# Altium schematic sheet pulsometro.SchDoc
size A3
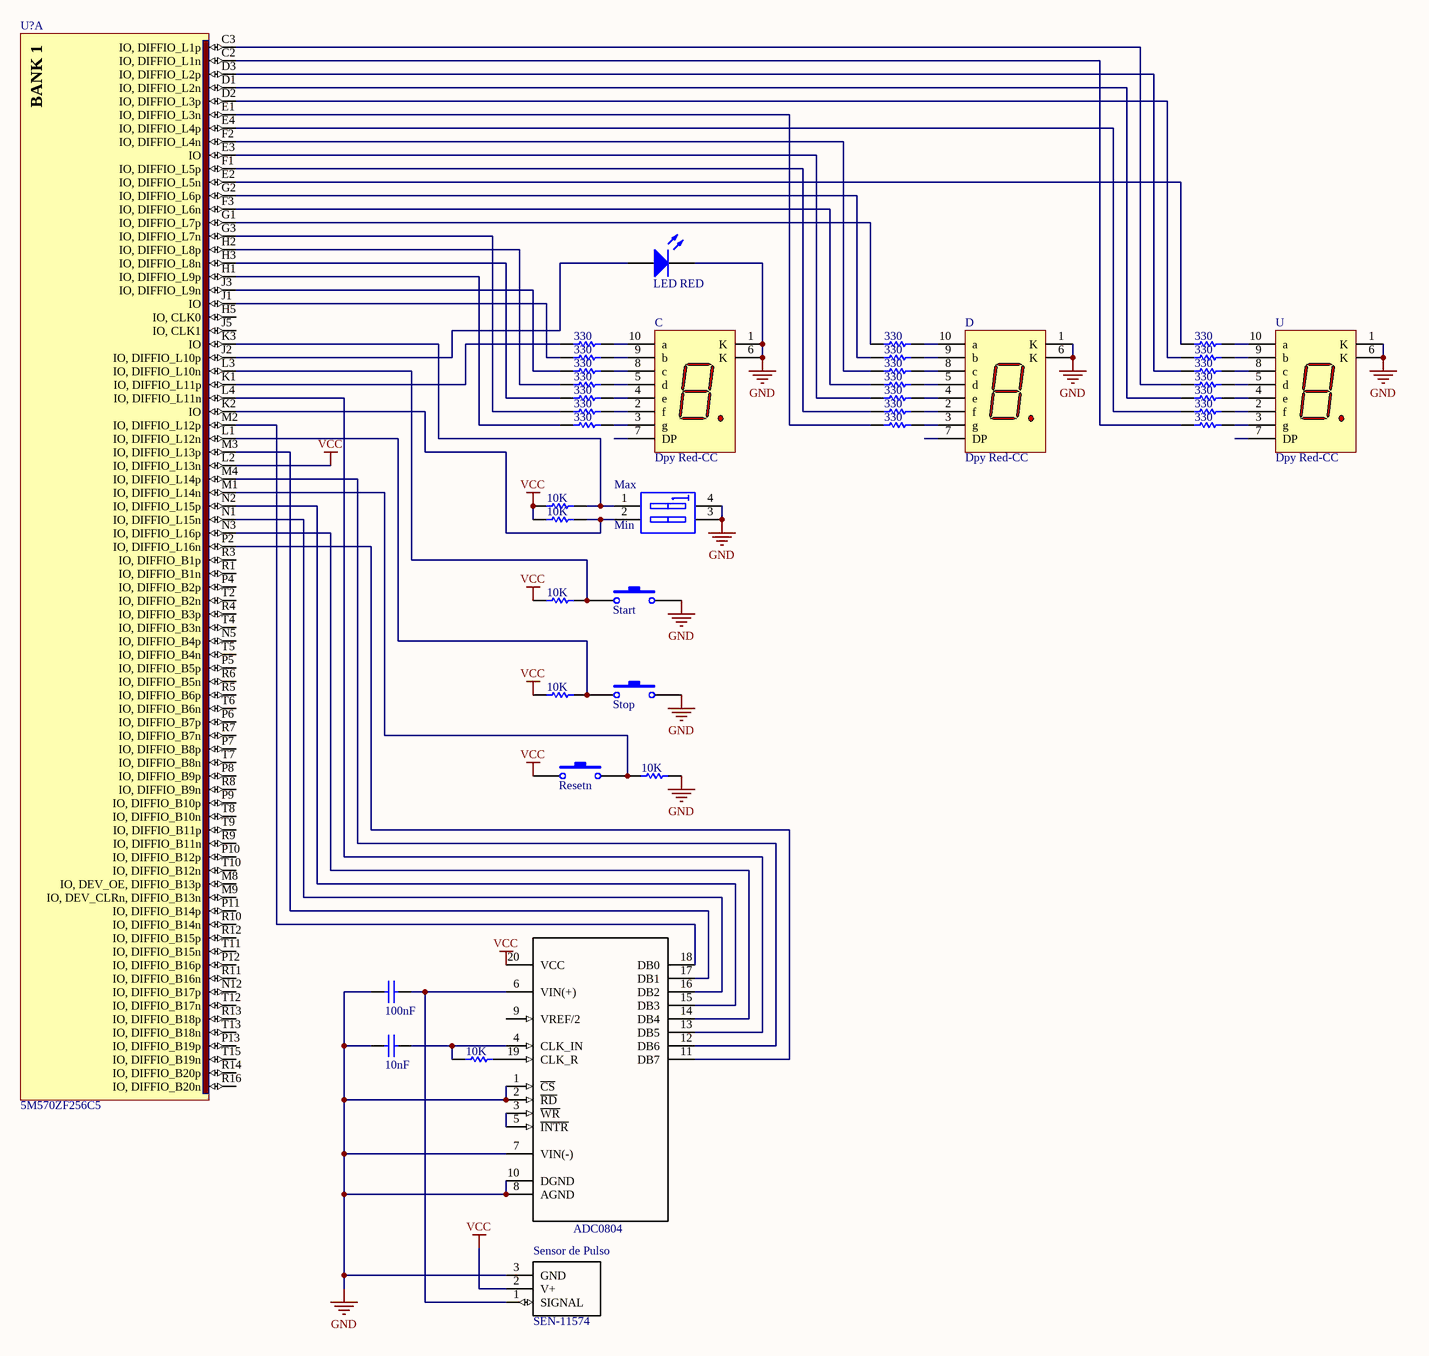
[diagram p0: pulsometro.SchDoc]

## Parts
(Parts that share a designator on the sheet are numbered #1, #2 ... from top to bottom, then left to right.)
C  Dpy Red-CC  [A]
C?#1  value 100nF  [RAD-0.3]  (hidden comment: Cap)
C?#2  value 10nF  [RAD-0.3]  (hidden comment: Cap)
D  Dpy Red-CC  [A]
D?  LED RED  [LED-0]
Max  Min  [DIP-4]
R?#1  value 330  [AXIAL-0.3]  (hidden comment: Res1)
R?#2  value 330  [AXIAL-0.3]  (hidden comment: Res1)
R?#3  value 330  [AXIAL-0.3]  (hidden comment: Res1)
R?#4  value 330  [AXIAL-0.3]  (hidden comment: Res1)
R?#5  value 330  [AXIAL-0.3]  (hidden comment: Res1)
R?#6  value 330  [AXIAL-0.3]  (hidden comment: Res1)
R?#7  value 330  [AXIAL-0.3]  (hidden comment: Res1)
R?#8  value 330  [AXIAL-0.3]  (hidden comment: Res1)
R?#9  value 330  [AXIAL-0.3]  (hidden comment: Res1)
R?#10  value 330  [AXIAL-0.3]  (hidden comment: Res1)
R?#11  value 330  [AXIAL-0.3]  (hidden comment: Res1)
R?#12  value 330  [AXIAL-0.3]  (hidden comment: Res1)
R?#13  value 330  [AXIAL-0.3]  (hidden comment: Res1)
R?#14  value 330  [AXIAL-0.3]  (hidden comment: Res1)
R?#15  value 330  [AXIAL-0.3]  (hidden comment: Res1)
R?#16  value 330  [AXIAL-0.3]  (hidden comment: Res1)
R?#17  value 330  [AXIAL-0.3]  (hidden comment: Res1)
R?#18  value 330  [AXIAL-0.3]  (hidden comment: Res1)
R?#19  value 330  [AXIAL-0.3]  (hidden comment: Res1)
R?#20  value 330  [AXIAL-0.3]  (hidden comment: Res1)
R?#21  value 330  [AXIAL-0.3]  (hidden comment: Res1)
R?#22  value 10K  [AXIAL-0.3]  (hidden comment: Res1)
R?#23  value 10K  [AXIAL-0.3]  (hidden comment: Res1)
R?#24  value 10K  [AXIAL-0.3]  (hidden comment: Res1)
R?#25  value 10K  [AXIAL-0.3]  (hidden comment: Res1)
R?#26  value 10K  [AXIAL-0.3]  (hidden comment: Res1)
R?#27  value 10K  [AXIAL-0.3]  (hidden comment: Res1)
S?#1  Start  [SPST-2]
S?#2  Stop  [SPST-2]
S?#3  Resetn  [SPST-2]
Sensor_de_Pulso  SEN-11574  [XDCR_SEN-11574]
U  Dpy Red-CC  [A]
U?#1  5M570ZF256C5  [FBGA256_A-155]  (part A of 5)
U?#2  ADC0804  [DIP254P762X508-20]

## Nets
GND: C.1(K) C.6(K) C?#1.1 C?#2.1 D.1(K) D.6(K) D?.2(K) Max.3(B2) Max.4(B1) R?#26.2 S?#1.2 S?#2.2 Sensor_de_Pulso.3(GND) U.1(K) U.6(K) U?#2.1(~{CS}) U?#2.2(~{RD}) U?#2.7(VIN(-)) U?#2.8(AGND) U?#2.10(DGND)
VCC: R?#22.1 R?#23.1 R?#24.1 R?#25.1 S?#3.1 Sensor_de_Pulso.2(V+) U?#1.L2(IO,_DIFFIO_L13n) U?#2.20(VCC)
NetC?#1_2: C?#1.2 Sensor_de_Pulso.1(SIGNAL) U?#2.6(VIN(+))
NetC?#2_2: C?#2.2 R?#27.1 U?#2.4(CLK_IN)
NetC_2: C.2(f) R?#16.2
NetC_3: C.3(g) R?#19.2
NetC_4: C.4(e) R?#13.2
NetC_5: C.5(d) R?#10.2
NetC_8: C.8(c) R?#7.2
NetC_9: C.9(b) R?#4.2
NetC_10: C.10(a) R?#1.2
NetD?_1: D?.1(A) U?#1.J2(IO,_DIFFIO_L10p)
NetD_2: D.2(f) R?#17.2
NetD_3: D.3(g) R?#20.2
NetD_4: D.4(e) R?#14.2
NetD_5: D.5(d) R?#11.2
NetD_8: D.8(c) R?#8.2
NetD_9: D.9(b) R?#5.2
NetD_10: D.10(a) R?#2.2
NetMax_1: Max.1(A1) R?#22.2 U?#1.K3(IO)
NetMax_2: Max.2(A2) R?#23.2 U?#1.K2(IO)
NetR?#1_1: R?#1.1 U?#1.K1(IO,_DIFFIO_L11p)
NetR?#2_1: R?#2.1 U?#1.G1(IO,_DIFFIO_L7p)
NetR?#3_1: R?#3.1 U?#1.E2(IO,_DIFFIO_L5n)
NetR?#3_2: R?#3.2 U.10(a)
NetR?#4_1: R?#4.1 U?#1.J1(IO)
NetR?#5_1: R?#5.1 U?#1.G2(IO,_DIFFIO_L6p)
NetR?#6_1: R?#6.1 U?#1.D2(IO,_DIFFIO_L3p)
NetR?#6_2: R?#6.2 U.9(b)
NetR?#7_1: R?#7.1 U?#1.J3(IO,_DIFFIO_L9n)
NetR?#8_1: R?#8.1 U?#1.F2(IO,_DIFFIO_L4n)
NetR?#9_1: R?#9.1 U?#1.D3(IO,_DIFFIO_L2p)
NetR?#9_2: R?#9.2 U.8(c)
NetR?#10_1: R?#10.1 U?#1.H2(IO,_DIFFIO_L8p)
NetR?#11_1: R?#11.1 U?#1.F3(IO,_DIFFIO_L6n)
NetR?#12_1: R?#12.1 U?#1.C3(IO,_DIFFIO_L1p)
NetR?#12_2: R?#12.2 U.5(d)
NetR?#13_1: R?#13.1 U?#1.H3(IO,_DIFFIO_L8n)
NetR?#14_1: R?#14.1 U?#1.E3(IO)
NetR?#15_1: R?#15.1 U?#1.D1(IO,_DIFFIO_L2n)
NetR?#15_2: R?#15.2 U.4(e)
NetR?#16_1: R?#16.1 U?#1.G3(IO,_DIFFIO_L7n)
NetR?#17_1: R?#17.1 U?#1.F1(IO,_DIFFIO_L5p)
NetR?#18_1: R?#18.1 U?#1.E4(IO,_DIFFIO_L4p)
NetR?#18_2: R?#18.2 U.2(f)
NetR?#19_1: R?#19.1 U?#1.H1(IO,_DIFFIO_L9p)
NetR?#20_1: R?#20.1 U?#1.E1(IO,_DIFFIO_L3n)
NetR?#21_1: R?#21.1 U?#1.C2(IO,_DIFFIO_L1n)
NetR?#21_2: R?#21.2 U.3(g)
NetR?#24_2: R?#24.2 S?#1.1 U?#1.L3(IO,_DIFFIO_L10n)
NetR?#25_2: R?#25.2 S?#2.1 U?#1.L1(IO,_DIFFIO_L12n)
NetR?#26_1: R?#26.1 S?#3.2 U?#1.M1(IO,_DIFFIO_L14n)
NetR?#27_2: R?#27.2 U?#2.19(CLK_R)
NetU?#1_L4: U?#1.L4(IO,_DIFFIO_L11n) U?#2.13(DB5)
NetU?#1_M2: U?#1.M2(IO,_DIFFIO_L12p) U?#2.18(DB0)
NetU?#1_M3: U?#1.M3(IO,_DIFFIO_L13p) U?#2.17(DB1)
NetU?#1_M4: U?#1.M4(IO,_DIFFIO_L14p) U?#2.12(DB6)
NetU?#1_N1: U?#1.N1(IO,_DIFFIO_L15n) U?#2.16(DB2)
NetU?#1_N2: U?#1.N2(IO,_DIFFIO_L15p) U?#2.15(DB3)
NetU?#1_N3: U?#1.N3(IO,_DIFFIO_L16p) U?#2.14(DB4)
NetU?#1_P2: U?#1.P2(IO,_DIFFIO_L16n) U?#2.11(DB7)
NetU?#2_3: U?#2.3(~{WR}) U?#2.5(~{INTR})

Not connected (* = marked no-connect by the designer): C 7(DP); D 7(DP); U 7(DP); U?#1 H5(IO,_CLK0) J5(IO,_CLK1) M8(IO,_DEV_OE,_DIFFIO_B13p) M9(IO,_DEV_CLRn,_DIFFIO_B13n) N5(IO,_DIFFIO_B4p) N12(IO,_DIFFIO_B17p) P4(IO,_DIFFIO_B2p) P5(IO,_DIFFIO_B5p) P6(IO,_DIFFIO_B7p) P7(IO,_DIFFIO_B8p) P8(IO,_DIFFIO_B9p) P9(IO,_DIFFIO_B10p) P10(IO,_DIFFIO_B12p) P11(IO,_DIFFIO_B14p) P12(IO,_DIFFIO_B16p) P13(IO,_DIFFIO_B19p) R1(IO,_DIFFIO_B1n) R3(IO,_DIFFIO_B1p) R4(IO,_DIFFIO_B3p) R5(IO,_DIFFIO_B6p) R6(IO,_DIFFIO_B5n) R7(IO,_DIFFIO_B7n) R8(IO,_DIFFIO_B9n) R9(IO,_DIFFIO_B11n) R10(IO,_DIFFIO_B14n) R11(IO,_DIFFIO_B16n) R12(IO,_DIFFIO_B15p) R13(IO,_DIFFIO_B18p) R14(IO,_DIFFIO_B20p) R16(IO,_DIFFIO_B20n) T2(IO,_DIFFIO_B2n) T4(IO,_DIFFIO_B3n) T5(IO,_DIFFIO_B4n) T6(IO,_DIFFIO_B6n) T7(IO,_DIFFIO_B8n) T8(IO,_DIFFIO_B10n) T9(IO,_DIFFIO_B11p) T10(IO,_DIFFIO_B12n) T11(IO,_DIFFIO_B15n) T12(IO,_DIFFIO_B17n) T13(IO,_DIFFIO_B18n) T15(IO,_DIFFIO_B19n); U?#2 9(VREF/2)

## Notes on the sheet
- (in symbol 5M570ZF256C5, part A) BANK 1

## Library data of the parts
C D U = Dpy Red-CC: 7.62 mm Black Surface HER 7-Segment Display: CC, RH DP; MinimumIntensity: 360 ucd; Note: IF = 5 mA; Note: Pins 1 and 6 are redundant Cathodes.; Published: 8-Jun-2000; LatestRevisionDate: 17-Dec-2003; LatestRevisionNote: Schematic revised, PCB Footprint replaced.; DatasheetVersion: 19-Feb-2002; PackageVersion: 11-Feb-2002; PackageReference: A; Publisher: Altium Limited; PackageDescription: LED, 7-Segment Display, 7.62 mm, RHD; 10 Leads; Row Space 5.08 mm; Pitch 2.54 mm; Colour: High Efficiency Red (HER); ComponentLink1Description: Manufacturer Link; ComponentLink1URL: http://www.agilent.com/
C?#1 C?#2 = Cap: Capacitor; Published: 8-Jun-2000; LatestRevisionDate: 17-Jul-2002; LatestRevisionNote: Re-released for DXP Platform.; PackageReference: RAD-0.3; Publisher: Altium Limited; PackageDescription: Radial Cap, Thru-Hole; 2 Leads; 0.3 in Pin Spacing
D? = LED0: Typical INFRARED GaAs LED; Published: 8-Jun-2000; LatestRevisionDate: 08-Jul-2005; LatestRevisionNote: Mech Layer 1 removed.; PackageReference: LED-0; Publisher: Altium Limited; PackageDescription: LED; 2 Leads
Max = SW DIP-2: DIP Switch, 2 Position, SPST; Published: 24-Mar-1999; LatestRevisionDate: 17-Jul-2002; LatestRevisionNote: Re-released for DXP Platform.; PackageReference: DIP-4; Publisher: Altium Limited
R?#1-R?#27 = Res1: Resistor; Published: 8-Jun-2000; LatestRevisionDate: 17-Jul-2002; LatestRevisionNote: Re-released for DXP Platform.; PackageReference: AXIAL-0.3; Publisher: Altium Limited; PackageDescription: Axial Device, Thru-Hole; 2 Leads; 0.3 in Pin Spacing
S?#1-S?#3 = SW-PB: Switch; Published: 24-Mar-1999; LatestRevisionDate: 17-Jul-2002; LatestRevisionNote: Re-released for DXP Platform.; PackageReference: SPST-2; Publisher: Altium Limited; PackageDescription: Switch; 2 Leads
Sensor_de_Pulso = SEN-11574: PULSE SENSOR FOR ARDUINO; MF: SparkFun; Package: None; MP: SEN-11574; Price: 24.94 USD; Availability: Bad; Value: *
U?#1 = 5M570ZF256C5: MAX V 1.8V CPLD, 159 IOs, 570 Logic Elements, 256-Pin FBGA, Commercial Temperature, Speed Grade 5; DatasheetVersion: ver1.2, May-2011; PackageVersion: ver2.0, Nov-2011; PackageReference: FBGA256_A-155; PackageDescription: 256-Pin FineLine Ball-Grid Array (FBGA) - Thin - Wire Bond - A:1.55; Code_JEDEC: MO-192-DAF-1; ComponentLink1Description: Manufacturer URL; ComponentLink1URL: http://www.altera.com/; ComponentLink2Description: Datasheet; ComponentLink2URL: http://www.altera.com/literature/hb/max-v/max5_handbook.pdf; ComponentLink3Description: MAX V Device Pin-Out files; ComponentLink3URL: http://www.altera.com/literature/lit-dp.jsp?category=MAX%205&showspreadsheet=y; ComponentLink4Description: Package Specification; ComponentLink4URL: http://www.altera.com/devicepackaging/04R-00230_03.pdf
U?#2 = ADC0804LCN: MP: ADC0804-LCN; MF: Analog Devices; Availability: Unavailable; Price: None; Package: DIP-20 Analog Devices; Value: *